# Altium schematic sheet ATmega128_MPU_Fab.SchDoc
size 439 x 299 mm
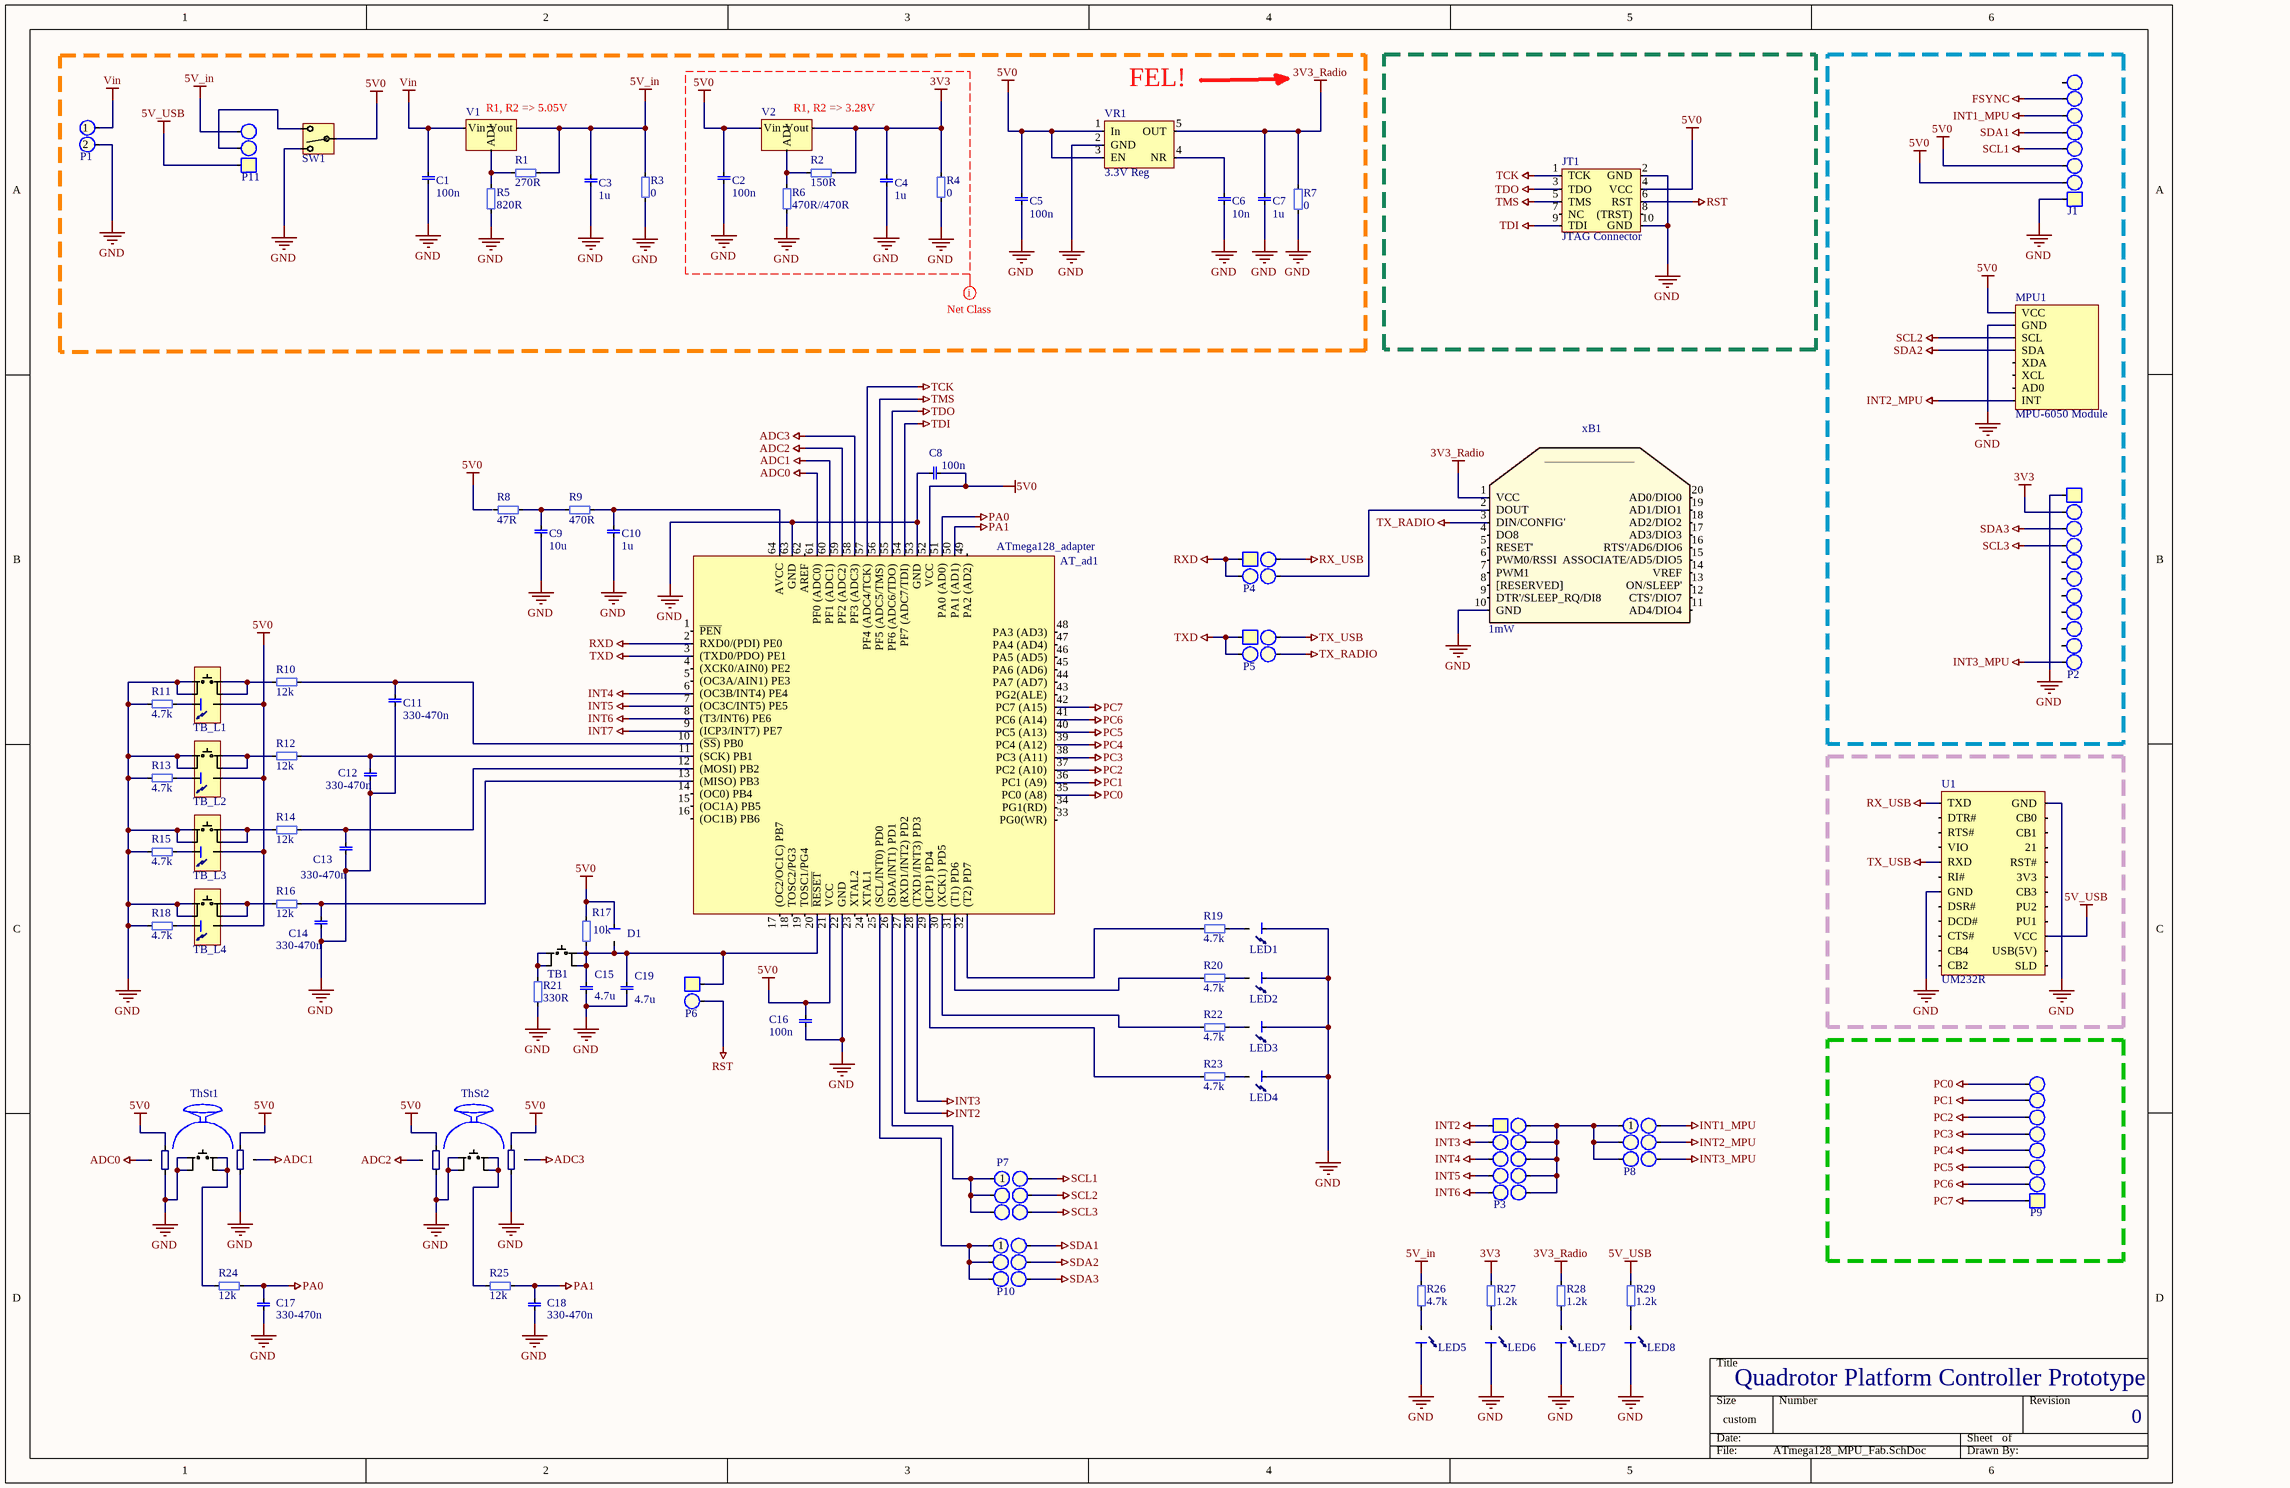
[diagram p0: ATmega128_MPU_Fab.SchDoc]

## Parts
AT_ad1  ATmega128_adapter  [Atmega128_adapter]
C1  value 100n  [0603 cap]  (hidden comment: 0603, capacitor)
C2  value 100n  [0603 cap]  (hidden comment: 0603, capacitor)
C3  value 1u  [0603 cap]  (hidden comment: 0603, capacitor)
C4  value 1u  [0603 cap]  (hidden comment: 0603, capacitor)
C5  value 100n  [0603 cap]  (hidden comment: 0603, capacitor)
C6  value 10n  [0603 cap]  (hidden comment: 0603, capacitor)
C7  value 1u  [0603 cap]  (hidden comment: 0603, capacitor)
C8  value 100n  [0603 cap]  (hidden comment: 0603, capacitor)
C9  value 10u  [0603 cap]  (hidden comment: 0603, capacitor)
C10  value 1u  [0603 cap]  (hidden comment: 0603, capacitor)
C11  value 330-470n  [0603 cap]  (hidden comment: 0603, capacitor)
C12  value 330-470n  [0603 cap]  (hidden comment: 0603, capacitor)
C13  value 330-470n  [0603 cap]  (hidden comment: 0603, capacitor)
C14  value 330-470n  [0603 cap]  (hidden comment: 0603, capacitor)
C15  value 4.7u  [1206, capasitor]  (hidden comment: 1206, capacitor)
C16  value 100n  [0603 cap]  (hidden comment: 0603, capacitor)
C17  value 330-470n  [0603 cap]  (hidden comment: 0603, capacitor)
C18  value 330-470n  [0603 cap]  (hidden comment: 0603, capacitor)
C19  value 4.7u  [1206, capasitor]  (hidden comment: 1206, capacitor)
D1  Diode, SOD-323  [SOD-323]  (value not drawn)
J1  1x8 Pin Header  [1x8 Pin HEader]  (value not drawn)
JT1  JTAG Connector  [Atmel_JTAG]
LED1  0805, LED  [0805_led]  (value not drawn)
LED2  0805, LED  [0805_led]  (value not drawn)
LED3  0805, LED  [0805_led]  (value not drawn)
LED4  0805, LED  [0805_led]  (value not drawn)
LED5  0805, LED  [0805_led]  (value not drawn)
LED6  0805, LED  [0805_led]  (value not drawn)
LED7  0805, LED  [0805_led]  (value not drawn)
LED8  0805, LED  [0805_led]  (value not drawn)
MPU1  MPU-6050 Module  [MPU-6050_MODULE]
P1  1x2 Pin Header  [padtwo_L]  (value not drawn)
P2  1x11 Pin Header  [1x11 Pin Header]  (value not drawn)
P3  2x5 Pin Header  [2x5 Pin Header]  (value not drawn)
P4  2x2 Pin Header  [2x2 PH]  (value not drawn)
P5  2x2 Pin Header  [2x2 PH]  (value not drawn)
P6  1x2 Pin Header  [padtwo_L]  (value not drawn)
P7  2x3 Pin Header  [2x3 PH]  (value not drawn)
P8  2x3 Pin Header  [2x3 PH]  (value not drawn)
P9  1x8 Pin Header  [1x8 Pin HEader]  (value not drawn)
P10  2x3 Pin Header  [2x3 PH]  (value not drawn)
P11  1x3 Pin Header  [padThree_L]  (value not drawn)
R1  value 270R  [0603]  (hidden comment: 0603, resistor)
R2  value 150R  [0603]  (hidden comment: 0603, resistor)
R3  value 0  [0603]  (hidden comment: 0603, resistor)
R4  value 0  [0603]  (hidden comment: 0603, resistor)
R5  value 820R  [0603]  (hidden comment: 0603, resistor)
R6  value 470R//470R  [0603]  (hidden comment: 0603, resistor)
R7  value 0  [0603]  (hidden comment: 0603, resistor)
R8  value 47R  [0603]  (hidden comment: 0603, resistor)
R9  value 470R  [0603]  (hidden comment: 0603, resistor)
R10  value 12k  [0603]  (hidden comment: 0603, resistor)
R11  value 4.7k  [0603]  (hidden comment: 0603, resistor)
R12  value 12k  [0603]  (hidden comment: 0603, resistor)
R13  value 4.7k  [0603]  (hidden comment: 0603, resistor)
R14  value 12k  [0603]  (hidden comment: 0603, resistor)
R15  value 4.7k  [0603]  (hidden comment: 0603, resistor)
R16  value 12k  [0603]  (hidden comment: 0603, resistor)
R17  value 10k  [0603]  (hidden comment: 0603, resistor)
R18  value 4.7k  [0603]  (hidden comment: 0603, resistor)
R19  value 4.7k  [0603]  (hidden comment: 0603, resistor)
R20  value 4.7k  [0603]  (hidden comment: 0603, resistor)
R21  value 330R  [0603]  (hidden comment: 0603, resistor)
R22  value 4.7k  [0603]  (hidden comment: 0603, resistor)
R23  value 4.7k  [0603]  (hidden comment: 0603, resistor)
R24  value 12k  [0603]  (hidden comment: 0603, resistor)
R25  value 12k  [0603]  (hidden comment: 0603, resistor)
R26  value 4.7k  [0603]  (hidden comment: 0603, resistor)
R27  value 1.2k  [0603]  (hidden comment: 0603, resistor)
R28  value 1.2k  [0603]  (hidden comment: 0603, resistor)
R29  value 1.2k  [0603]  (hidden comment: 0603, resistor)
SW1  Switch  [Switch]  (value not drawn)
TB1  Tactile Button  [tacButton]  (value not drawn)
TB_L1  Tactile Button  [Button_Large]  (value not drawn)
TB_L2  Tactile Button  [Button_Large]  (value not drawn)
TB_L3  Tactile Button  [Button_Large]  (value not drawn)
TB_L4  Tactile Button  [Button_Large]  (value not drawn)
ThSt1  ThumbStick  [ThumbStick]  (value not drawn)
ThSt2  ThumbStick  [ThumbStick]  (value not drawn)
U1  UM232R  [UM232R]
V1  LM317*  [SOT223]  (value not drawn)
V2  LM317*  [SOT223]  (value not drawn)
VR1  3.3V Reg  [SOT23-5]
xB1  value 1mW  [xBee_S2]  (hidden comment: xBeeS2)

## Blocks framed on the sheet
FEL!: C1-C7 P1 P11 R1-R7 SW1 V1 V2 VR1

## Nets
3V3: C4.1 P2.2 R2.1 R4.1 R27.0 V2.2(Vout)
3V3_Radio: C7.1 R7.1 R28.0 VR1.5(OUT) xB1.1(VCC)
5V0: AT_ad1.21(VCC) AT_ad1.52(VCC) C2.1 C5.1 C8.0 C16.1 D1.2 J1.2 J1.3 JT1.4(VCC) MPU1.1(VCC) R17.0 SW1.2 TB_L1.5 TB_L2.5 TB_L3.5 TB_L4.5 ThSt1.1 ThSt1.10 ThSt2.1 ThSt2.10 V2.3(Vin) VR1.1(In) VR1.3(EN)
5V_in: C3.1 P11.3 R1.1 R3.1 R26.0 V1.2(Vout)
5V_USB: P11.1 R29.0 U1.15(VCC)
ADC0: AT_ad1.61(PF0_(ADC0)) ThSt1.2
ADC1: AT_ad1.60(PF1_(ADC1)) ThSt1.9
ADC2: AT_ad1.59(PF2_(ADC2)) ThSt2.2
ADC3: AT_ad1.58(PF3_(ADC3)) ThSt2.9
FSYNC: J1.7
GND: AT_ad1.22(GND) AT_ad1.53(GND) AT_ad1.63(GND) C1.0 C2.0 C3.0 C4.0 C5.0 C6.0 C7.0 C8.1 C9.1 C10.0 C11.1 C12.1 C13.1 C14.1 C15.0 C16.0 C17.1 C18.1 C19.0 J1.1 JT1.2(GND) JT1.10(GND) LED1.0 LED2.0 LED3.0 LED4.0 LED5.0 LED6.0 LED7.0 LED8.0 MPU1.2(GND) P1.2 P2.1 R3.0 R4.0 R5.1 R6.1 R7.0 R11.1 R13.1 R15.1 R18.1 R21.1 SW1.1 TB_L1.3 TB_L1.4 TB_L2.3 TB_L2.4 TB_L3.3 TB_L3.4 TB_L4.3 TB_L4.4 ThSt1.3 ThSt1.4 ThSt1.5 ThSt1.8 ThSt2.3 ThSt2.4 ThSt2.5 ThSt2.8 U1.7(GND) U1.24(GND) VR1.2(GND) xB1.10(GND)
INT1_MPU: J1.6 P8.6
INT2: AT_ad1.27((RXD1/INT2)_PD2) P3.1
INT2_MPU: MPU1.8(INT) P8.5
INT3: AT_ad1.28((TXD1/INT3)_PD3) P3.2
INT3_MPU: P2.11 P8.4
INT4: AT_ad1.6((OC3B/INT4)_PE4) P3.3
INT5: AT_ad1.7((OC3C/INT5)_PE5) P3.4
INT6: AT_ad1.8((T3/INT6)_PE6) P3.5
INT7: AT_ad1.9((ICP3/INT7)_PE7)
PA0: AT_ad1.51(PA0_(AD0)) C17.0 R24.0
PA1: AT_ad1.50(PA1_(AD1)) C18.0 R25.0
PC0: AT_ad1.35(PC0_(A8)) P9.8
PC1: AT_ad1.36(PC1_(A9)) P9.7
PC2: AT_ad1.37(PC2_(A10)) P9.6
PC3: AT_ad1.38(PC3_(A11)) P9.5
PC4: AT_ad1.39(PC4_(A12)) P9.4
PC5: AT_ad1.40(PC5_(A13)) P9.3
PC6: AT_ad1.41(PC6_(A14)) P9.2
PC7: AT_ad1.42(PC7_(A15)) P9.1
RST: JT1.6(RST) P6.2
RX_USB: P4.4 U1.1(TXD)
RXD: AT_ad1.2(RXD0/(PDI)_PE0) P4.1 P4.2
SCL1: J1.4 P7.6
SCL2: MPU1.3(SCL) P7.5
SCL3: P2.4 P7.4
SDA1: J1.5 P10.6
SDA2: MPU1.4(SDA) P10.5
SDA3: P2.3 P10.4
TCK: AT_ad1.57(PF4_(ADC4/TCK)) JT1.1(TCK)
TDI: AT_ad1.54(PF7_(ADC7/TDI)) JT1.9(TDI)
TDO: AT_ad1.55(PF6_(ADC6/TDO)) JT1.3(TDO)
TMS: AT_ad1.56(PF5_(ADC5/TMS)) JT1.5(TMS)
TX_RADIO: P5.3 xB1.3(DIN/CONFIG')
TX_USB: P5.4 U1.5(RXD)
TXD: AT_ad1.3((TXD0/PDO)_PE1) P5.1 P5.2
Vin: C1.1 P1.1 V1.3(Vin)
NetAT_ad1_10: AT_ad1.10((~{SS})_PB0) C11.0 R10.0
NetAT_ad1_11: AT_ad1.11((SCK)_PB1) C12.0 R12.0
NetAT_ad1_12: AT_ad1.12((MOSI)_PB2) C13.0 R14.0
NetAT_ad1_13: AT_ad1.13((MISO)_PB3) C14.0 R16.0
NetAT_ad1_20: AT_ad1.20(~{RESET}) C15.1 C19.1 D1.1 P6.1 R17.1 TB1.1 TB1.2
NetAT_ad1_25: AT_ad1.25((SCL/INT0)_PD0) P10.1 P10.2 P10.3
NetAT_ad1_26: AT_ad1.26((SDA/INT1)_PD1) P7.1 P7.2 P7.3
NetAT_ad1_29: AT_ad1.29((ICP1)_PD4) R23.0
NetAT_ad1_30: AT_ad1.30((XCK1)_PD5) R22.0
NetAT_ad1_31: AT_ad1.31((T1)_PD6) R20.0
NetAT_ad1_32: AT_ad1.32((T2)_PD7) R19.0
NetAT_ad1_64: AT_ad1.64(AVCC) C10.1 R9.0
NetC6_1: C6.1 VR1.4(NR)
NetC9_0: C9.0 R8.1 R9.1
NetLED1_1: LED1.1 R19.1
NetLED2_1: LED2.1 R20.1
NetLED3_1: LED3.1 R22.1
NetLED4_1: LED4.1 R23.1
NetLED5_1: LED5.1 R26.1
NetLED6_1: LED6.1 R27.1
NetLED7_1: LED7.1 R28.1
NetLED8_1: LED8.1 R29.1
NetP3_6: P3.6 P3.7 P3.8 P3.9 P3.10 P8.1 P8.2 P8.3
NetP4_3: P4.3 xB1.2(DOUT)
NetP11_2: P11.2 SW1.3
NetR1_0: R1.0 R5.0 V1.1(ADJ)
NetR2_0: R2.0 R6.0 V2.1(ADJ)
NetR10_1: R10.1 TB_L1.1 TB_L1.2
NetR11_0: R11.0 TB_L1.6
NetR12_1: R12.1 TB_L2.1 TB_L2.2
NetR13_0: R13.0 TB_L2.6
NetR14_1: R14.1 TB_L3.1 TB_L3.2
NetR15_0: R15.0 TB_L3.6
NetR16_1: R16.1 TB_L4.1 TB_L4.2
NetR18_0: R18.0 TB_L4.6
NetR21_0: R21.0 TB1.3 TB1.4
NetR24_1: R24.1 ThSt1.6 ThSt1.7
NetR25_1: R25.1 ThSt2.6 ThSt2.7

Not connected (* = marked no-connect by the designer): AT_ad1 1(~{PEN}) 4((XCK0/AIN0)_PE2) 5((OC3A/AIN1)_PE3) 14((OC0)_PB4) 15((OC1A)_PB5) 16((OC1B)_PB6) 17((OC2/OC1C)_PB7) 18(TOSC2/PG3) 19(TOSC1/PG4) 23(XTAL2) 24(XTAL1) 33(PG0(WR)) 34(PG1(RD)) 43(PG2(ALE)) 44(PA7_(AD7)) 45(PA6_(AD6)) 46(PA5_(AD5)) 47(PA4_(AD4)) 48(PA3_(AD3)) 49(PA2_(AD2)) 62(AREF); J1 8; JT1 7(NC) 8((TRST)); MPU1 5(XDA) 6(XCL) 7(AD0); P2 5 6 7 8 9 10; R8 0; U1 2(DTR#) 3(RTS#) 4(VIO) 6(RI#) 8(DSR#) 9(DCD#) 10(CTS#) 11(CB4) 12(CB2) 13(SLD) 14(USB(5V)) 16(PU1) 17(PU2) 18(CB3) 19(3V3) 20(RST#) 21 22(CB1) 23(CB0); xB1 4(DO8) 5(RESET') 6(PWM0/RSSI) 7(PWM1) 8([RESERVED]) 9(DTR'/SLEEP_RQ/DI8) 11(AD4/DIO4) 12(CTS'/DIO7) 13(ON/SLEEP') 14(VREF) 15(ASSOCIATE/AD5/DIO5) 16(RTS'/AD6/DIO6) 17(AD3/DIO3) 18(AD2/DIO2) 19(AD1/DIO1) 20(AD0/DIO0)

## Layout directives
net class 3V3_Reg: 3V3, 5V0, GND

## Notes on the sheet
- (near V1) R1, R2 => 5.05V
- (near V2) R1, R2 => 3.28V
- Quadrotor Platform Controller Prototype
- 0

## Library data of the parts
J1 P9 = 1x8 Pin Header: 2.54 mm; Value: 1x8 Pin Header
JT1 = Atmel JTAG: Atmel JTAG Connector
LED1-LED8 = 0805, LED: Value: 0805 LED
P1 P6 = 1x2 Pin Header: 2.54 mm, TH; Value: 1x2 Pin Header
P2 = 1x11 Pin Header: 2.54 mm; Value: 1x8 Pin Header
P3 = 2x5 Pin Header: 2.54mm, PH; Value: 2x5 Pin Header, 2.54mm, Th
P4 P5 = 2x2 Pin Header: Value: 2x2 Pin Header, 2.54mm
P7 P8 P10 = 2x3 Pin Header: Value: 2x3 Pin Header, 2.54mm
P11 = 1x3 Pin Header: 2.54 mm; Value: 1x3 Pin Header
SW1 = Switch: Value: Toggle Switch
TB1 = TacButton: Tactile Switch Small Low
TB_L1-TB_L4 = TacButton_Large: Tactile Switch Small Low; Value: Tactile Button Large
V1 V2 = LM317_SOT223: Adjustable Voltage Regulator; Value: LM317; Farnell: 1469023
VR1 = TPS79333DBR: 3.3V Reg, Ultra-Low Noise, 200 mA; Value: TPS79333DBVR; Farnell: 1287689
AT_ad1 = ATmega128_adapter: Value: ATmega128_adapter
ThSt1 ThSt2 = ThumbStick: Value: Thumbstick